# EAGLE design Seguidor (EAGLE 7.7.0)
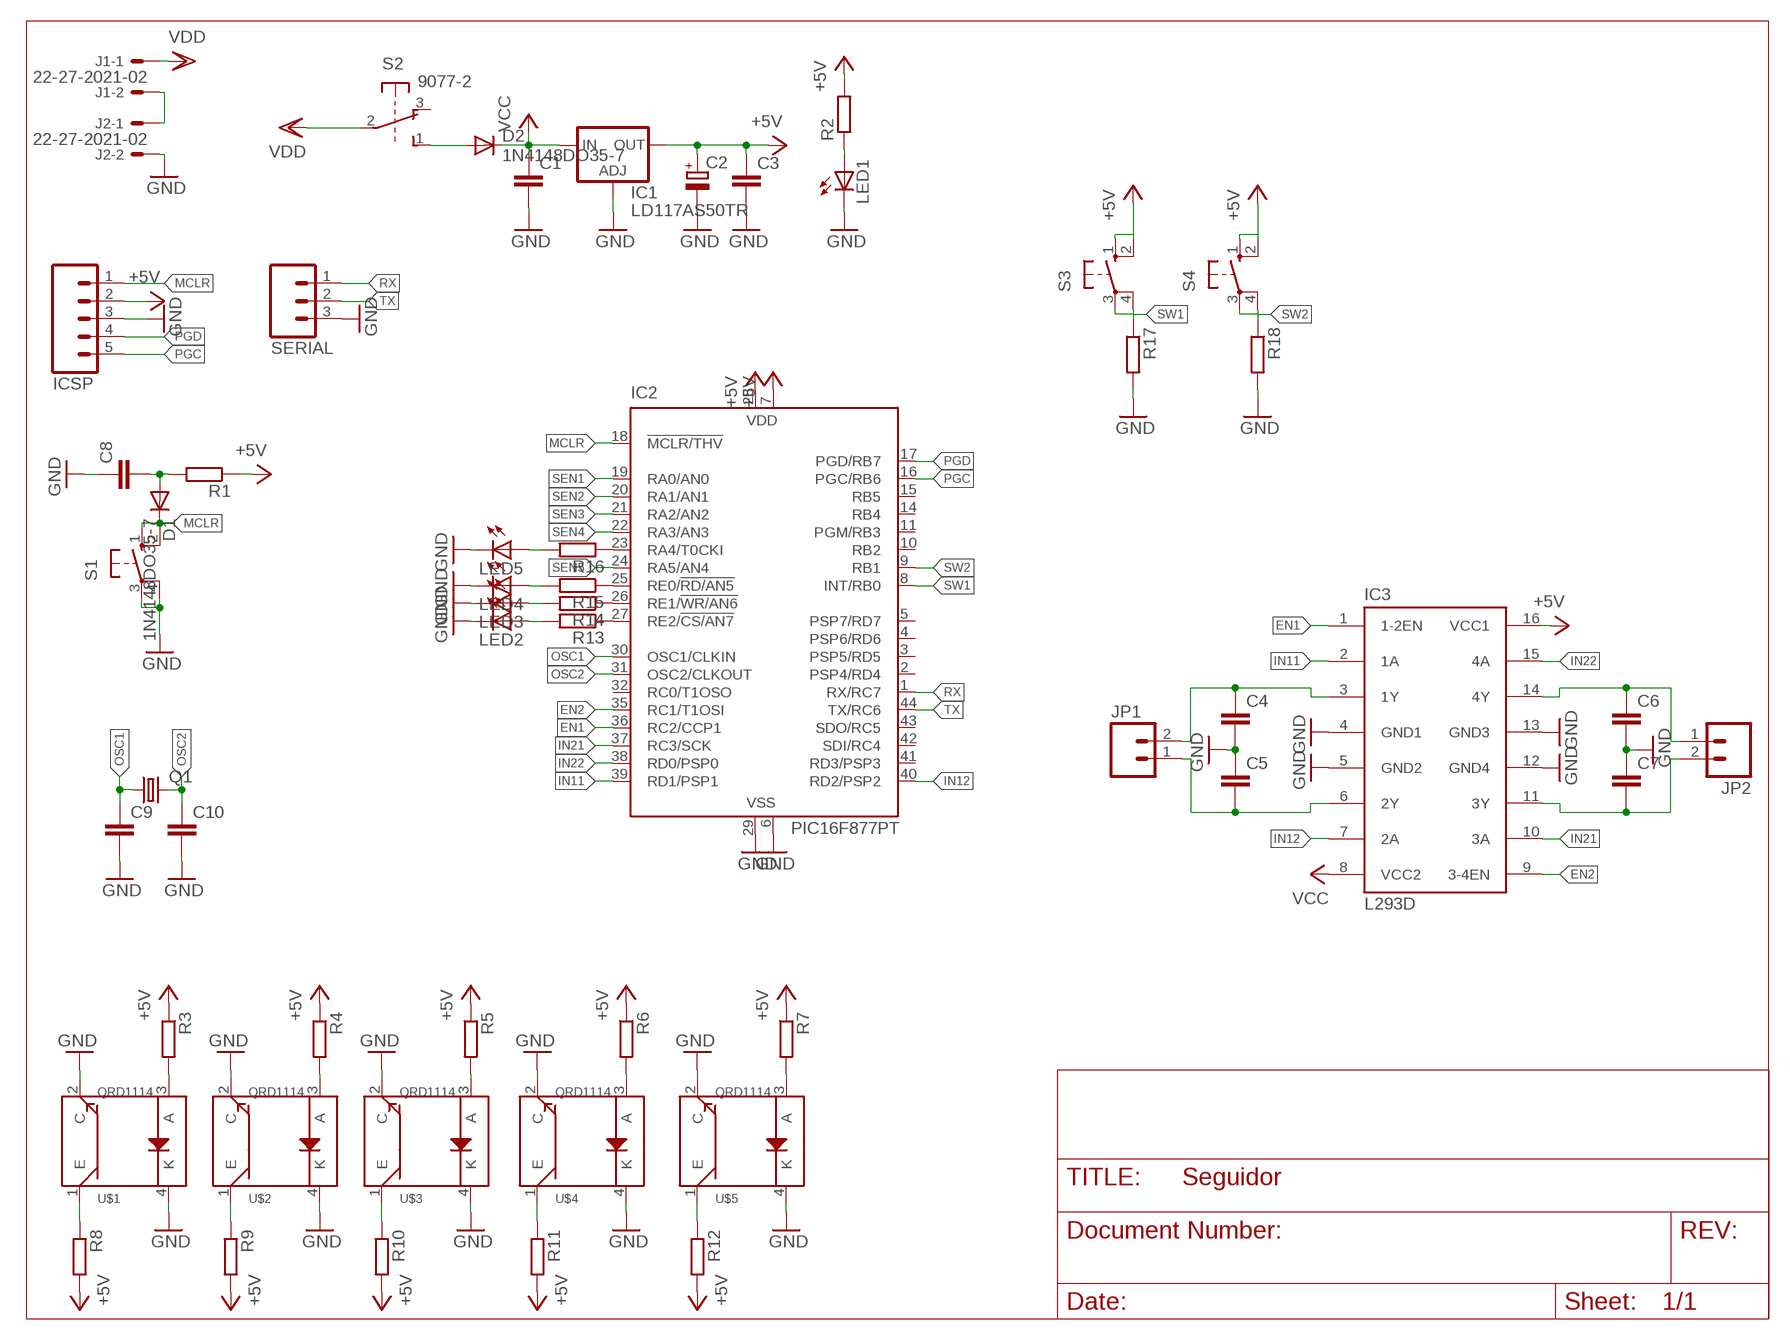
[diagram p0: schematic, sheet 1]

## Parts
C1  C-EU050-024X044  [C050-024X044]
C2  CPOL-EU153CLV-0405  [153CLV-0405]
C3  C-EU050-024X044  [C050-024X044]
C4  C-EU050-024X044  [C050-024X044]
C5  C-EU050-024X044  [C050-024X044]
C6  C-EU050-024X044  [C050-024X044]
C7  C-EU050-024X044  [C050-024X044]
C8  C-EU050-024X044  [C050-024X044]
C9  C-EU050-024X044  [C050-024X044]
C10  C-EU050-024X044  [C050-024X044]
D1  1N4148DO35-7  [DO35-7]
D2  1N4148DO35-7  [DO35-7]
IC1  LD117AS50TR  [SOT223]
IC2  PIC16F877PT  [TQFP44]
IC3  L293D  [DIL16]
ICSP  M05PTH_LONGPADS  [1X05_LONGPADS]
J1  22-27-2021-02  [6410-02]
J2  22-27-2021-02  [6410-02]
JP1  M02  [1X02_LONGPADS]
JP2  M02  [1X02_LONGPADS]
LED1  LED3MM  [LED3MM]
LED2  LED3MM  [LED3MM]
LED3  LED3MM  [LED3MM]
LED4  LED3MM  [LED3MM]
LED5  LED3MM  [LED3MM]
Q1  CRYSTALHC49UP  [HC49UP]
R1  R-EU_0207/7  [0207/7]
R2  R-EU_0207/7  [0207/7]
R3  R-EU_0207/7  [0207/7]
R4  R-EU_0207/7  [0207/7]
R5  R-EU_0207/7  [0207/7]
R6  R-EU_0207/7  [0207/7]
R7  R-EU_0207/7  [0207/7]
R8  R-EU_0207/7  [0207/7]
R9  R-EU_0207/7  [0207/7]
R10  R-EU_0207/7  [0207/7]
R11  R-EU_0207/7  [0207/7]
R12  R-EU_0207/7  [0207/7]
R13  R-EU_0207/7  [0207/7]
R14  R-EU_0207/7  [0207/7]
R15  R-EU_0207/7  [0207/7]
R16  R-EU_0207/7  [0207/7]
R17  R-EU_0207/7  [0207/7]
R18  R-EU_0207/7  [0207/7]
S1  10-XX  [B3F-10XX]
S2  9077-2  [9077-2]
S3  10-XX  [B3F-10XX]
S4  10-XX  [B3F-10XX]
SERIAL  M03LOCK_LONGPADS  [1X03_LOCK_LONGPADS]
U$1  QRD1114  [QRD1114]
U$2  QRD1114  [QRD1114]
U$3  QRD1114  [QRD1114]
U$4  QRD1114  [QRD1114]
U$5  QRD1114  [QRD1114]

## Nets
+5V: C2.+ C3.1 IC1.4(OUT) IC2.7(VDD) IC2.28(VDD) IC3.16(VCC1) ICSP.2 R1.1 R2.2 R3.1 R4.1 R5.1 R6.1 R7.1 R8.2 R9.2 R10.2 R11.2 R12.2 S3.1(S) S3.2(S1) S4.1(S) S4.2(S1)
EN1: IC2.36(RC2/CCP1) IC3.1(1-2EN)
EN2: IC2.35(RC1/T1OSI) IC3.9(3-4EN)
GND: C1.2 C2.- C3.2 C4.2 C5.1 C6.2 C7.1 C8.1 C9.2 C10.2 IC1.1(ADJ) IC2.6(VSS) IC2.29(VSS) IC3.4(GND1) IC3.5(GND2) IC3.12(GND4) IC3.13(GND3) ICSP.3 J2.2 LED1.K(C) LED2.K(C) LED3.K(C) LED4.K(C) LED5.K(C) R17.2 R18.2 S1.3(P) S1.4(P1) SERIAL.3 U$1.2(C) U$1.4(K) U$2.2(C) U$2.4(K) U$3.2(C) U$3.4(K) U$4.2(C) U$4.4(K) U$5.2(C) U$5.4(K)
IN11: IC2.39(RD1/PSP1) IC3.2(1A)
IN12: IC2.40(RD2/PSP2) IC3.7(2A)
IN21: IC2.37(RC3/SCK) IC3.10(3A)
IN22: IC2.38(RD0/PSP0) IC3.15(4A)
MCLR: D1.C IC2.18(!MCLR/THV) ICSP.1 S1.1(S) S1.2(S1)
N$1: J1.2 J2.1
N$2: LED1.A R2.1
N$3: C6.1 IC3.14(4Y) JP2.1
N$4: C4.1 IC3.3(1Y) JP1.2
N$5: C5.2 IC3.6(2Y) JP1.1
N$6: C7.2 IC3.11(3Y) JP2.2
N$7: D2.A S2.1(1:S)
N$9: C8.2 D1.A R1.2
N$10: R3.2 U$1.3(A)
N$11: R4.2 U$2.3(A)
N$12: R5.2 U$3.3(A)
N$13: R6.2 U$4.3(A)
N$14: R7.2 U$5.3(A)
N$15: IC2.27(RE2/!CS/AN7) R13.1
N$16: IC2.26(RE1/!WR/AN6) R14.1
N$17: IC2.25(RE0/!RD/AN5) R15.1
N$18: IC2.23(RA4/T0CKI) R16.1
N$19: LED3.A R14.2
N$20: LED2.A R13.2
N$21: LED4.A R15.2
N$22: LED5.A R16.2
OSC1: C9.1 IC2.30(OSC1/CLKIN) Q1.1
OSC2: C10.1 IC2.31(OSC2/CLKOUT) Q1.2
PGC: IC2.16(PGC/RB6) ICSP.5
PGD: IC2.17(PGD/RB7) ICSP.4
RX: IC2.1(RX/RC7) SERIAL.1
SEN1: IC2.19(RA0/AN0) R8.1 U$1.1(E)
SEN2: IC2.20(RA1/AN1) R9.1 U$2.1(E)
SEN3: IC2.21(RA2/AN2) R10.1 U$3.1(E)
SEN4: IC2.22(RA3/AN3) R11.1 U$4.1(E)
SEN5: IC2.24(RA5/AN4) R12.1 U$5.1(E)
SW1: IC2.8(INT/RB0) R17.1 S3.3(P) S3.4(P1)
SW2: IC2.9(RB1) R18.1 S4.3(P) S4.4(P1)
TX: IC2.44(TX/RC6) SERIAL.2
VCC: C1.1 D2.C IC1.3(IN) IC3.8(VCC2)
VDD: J1.1 S2.2(1:P)
Unconnected: IC2.2(PSP4/RD4) IC2.3(PSP5/RD5) IC2.4(PSP6/RD6) IC2.5(PSP7/RD7) IC2.10(RB2) IC2.11(PGM/RB3) IC2.14(RB4) IC2.15(RB5) IC2.32(RC0/T1OSO) IC2.41(RD3/PSP3) IC2.42(SDI/RC4) IC2.43(SDO/RC5) S2.3(1:O) S2.4(2:S) S2.5(2:P) S2.6(2:O)

## Library data of the parts
C1 C3-C10 = rcl:C-EU: CAPACITOR, European symbol
C2 = rcl:CPOL-EU: POLARIZED CAPACITOR, European symbol
D1 D2 = diode:1N4148: DIODE high speed (Philips)
IC1 = v-reg:LD117A?*: Low drop fixed and adjustable positive voltage regulators 1 A Source: http://www.st.com/stonline/products/literature/ds/7194/ld1117axx.pdf
IC2 = microchip:PIC16F87*: MICROCONTROLLER; MF: MICROCHIP; MPN: PIC16F877-04/PQ; OC_FARNELL: 9761411; OC_NEWARK: 23C5094
IC3 = st-microelectronics:L293D: PUSH-PULL 4 CHANNEL DRIVER; MPN: L293D; OC_FARNELL: 9589619; OC_NEWARK: 56P8249
ICSP = SparkFun:M05: Header 5 Standard 5-pin 0.1" header. Use with straight break away headers (SKU : PRT-00116), right angle break away headers (PRT-00553), swiss pins (PRT-00743), machine pins (PRT-00117), and female headers (PRT-00115). Molex polarized connector foot print use with SKU : PRT-08230 with associated crimp pins and housings.
J1 J2 = con-molex:22-?-02: CONNECTOR wire to board 2.54 mm (.1 inch) pitch header; OC_FARNELL: unknown; OC_NEWARK: unknown
JP1 JP2 = SparkFun:M02: Header 2 Standard 2-pin 0.1" header. Use with straight break away headers (SKU : PRT-00116), right angle break away headers (PRT-00553), swiss pins (PRT-00743), machine pins (PRT-00117), and female headers (PRT-00115). Molex polarized connector foot print use with SKU : PRT-08233 with associated crimp pins and housings.
LED1-LED5 = led:LED: LED OSRAM: - CHIPLED LG R971, LG N971, LY N971, LG Q971, LY Q971, LO R971, LY R971 LH N974, LH R974 LS Q976, LO Q976, LY Q976 LO Q996 - Hyper CHIPLED LW Q18S LB Q993, LB Q99A, LB R99A - SideLED LS A670, LO A670, LY A670, LG A670, LP A670 LB A673, LV A673, LT A673, LW A673 LH A674 LY A675 LS A676, LA A676, LO A676, LY A676, LW A676 LS A679, LY A679, LG A679 - Hyper Micro SIDELED® LS Y876, LA Y876, LO Y876, LY Y876 LT Y87S - SmartLED LW L88C, LW L88S LB L89C, LB L89S, LG L890 LS L89K, LO L89K, LY L89K LS L896, LA L896, LO L896, LY L896 - TOPLED LS T670, LO T670, LY T670, LG T670, LP T670 LSG T670, LSP T670, LSY T670, LOP T670, LYG T670 LG T671, LOG T671, LSG T671 LB T673, LV T673, LT T673, LW T673 LH T674 LS T676, LA T676, LO T676, LY T676, LB T676, LH T676, LSB T676, LW T676 LB T67C, LV T67C, LT T67C, LS T67K, LO T67K, LY T67K, LW E67C LS E67B, LA E67B, LO E67B, LY E67B, LB E67C, LV E67C, LT E67C LW T67C LS T679, LY T679, LG T679 LS T770, LO T770, LY T770, LG T770, LP T770 LB T773, LV T773, LT T773, LW T773 LH T774 LS E675, LA E675, LY E675, LS T675 LS T776, LA T776, LO T776, LY T776, LB T776 LHGB T686 LT T68C, LB T68C - Hyper Mini TOPLED® LB M676 - Mini TOPLED Santana® LG M470 LS M47K, LO M47K, LY M47K Source: http://www.osram.convergy.de LUXEON: - LUMILED® LXK2-PW12-R00, LXK2-PW12-S00, LXK2-PW14-U00, LXK2-PW14-V00 LXK2-PM12-R00, LXK2-PM12-S00, LXK2-PM14-U00 LXK2-PE12-Q00, LXK2-PE12-R00, LXK2-PE12-S00, LXK2-PE14-T00, LXK2-PE14-U00 LXK2-PB12-K00, LXK2-PB12-L00, LXK2-PB12-M00, LXK2-PB14-N00, LXK2-PB14-P00, LXK2-PB14-Q00 LXK2-PR12-L00, LXK2-PR12-M00, LXK2-PR14-Q00, LXK2-PR14-R00 LXK2-PD12-Q00, LXK2-PD12-R00, LXK2-PD12-S00 LXK2-PH12-R00, LXK2-PH12-S00 LXK2-PL12-P00, LXK2-PL12-Q00, LXK2-PL12-R00 Source: www.luxeon.com KINGBRIGHT: KA-3528ASYC Source: www.kingbright.com
Q1 = crystal:CRYSTAL: CRYSTAL; OC_FARNELL: unknown; OC_NEWARK: unknown
R1-R18 = rcl:R-EU_: RESISTOR, European symbol
S1 S3 S4 = switch-omron:10-XX: OMRON SWITCH; MPN: B3F-1000; OC_FARNELL: 176432; OC_NEWARK: 36M3542
S2 = switch-misc:9077-2: MARQUARDT SWITCH 9077.0200 Distributor: Buerklin <https://www.buerklin.com/default.asp?event=ShowArtikel%2812G2822%29&l=d&jump=ArtNr_12G2822>
SERIAL = SparkFun:M03: Header 3 Standard 3-pin 0.1" header. Use with straight break away headers (SKU : PRT-00116), right angle break away headers (PRT-00553), swiss pins (PRT-00743), machine pins (PRT-00117), and female headers (PRT-00115). Molex polarized connector foot print use with SKU : PRT-08232 with associated crimp pins and housings.
U$1-U$5 = SparkFun:QRD1114

## Board
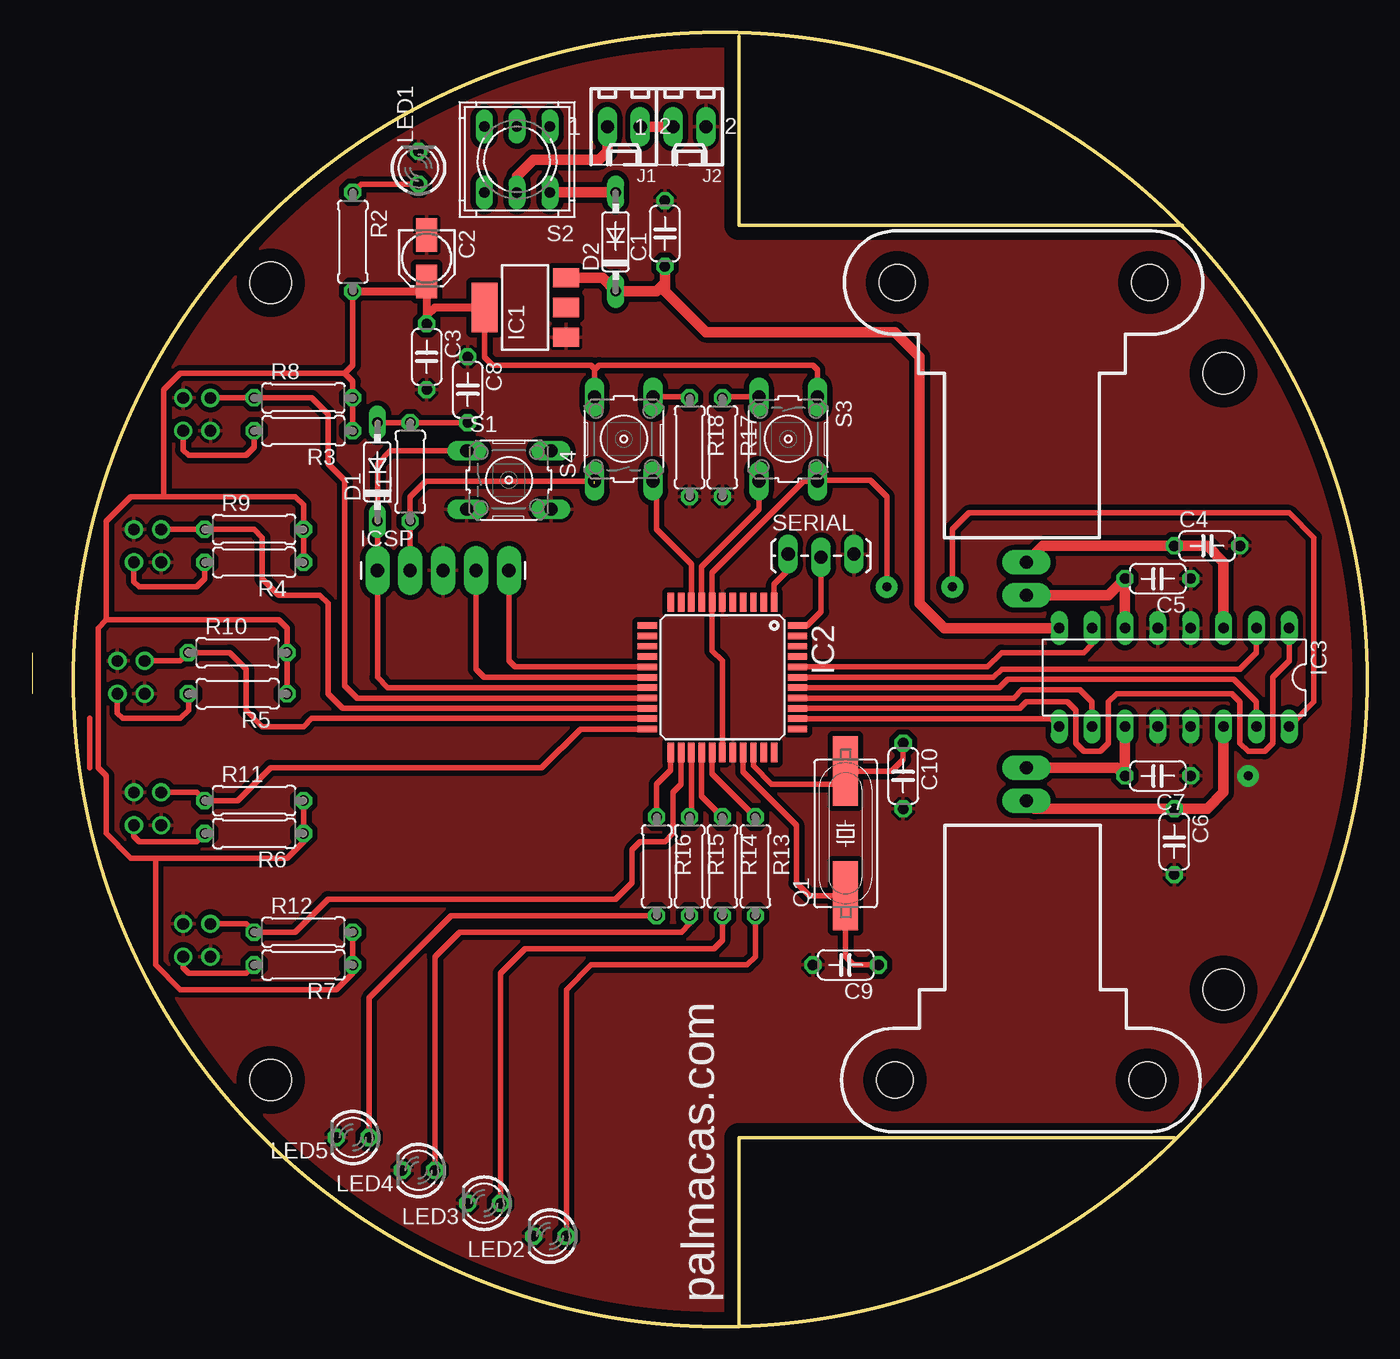
[diagram p1: board, top side]
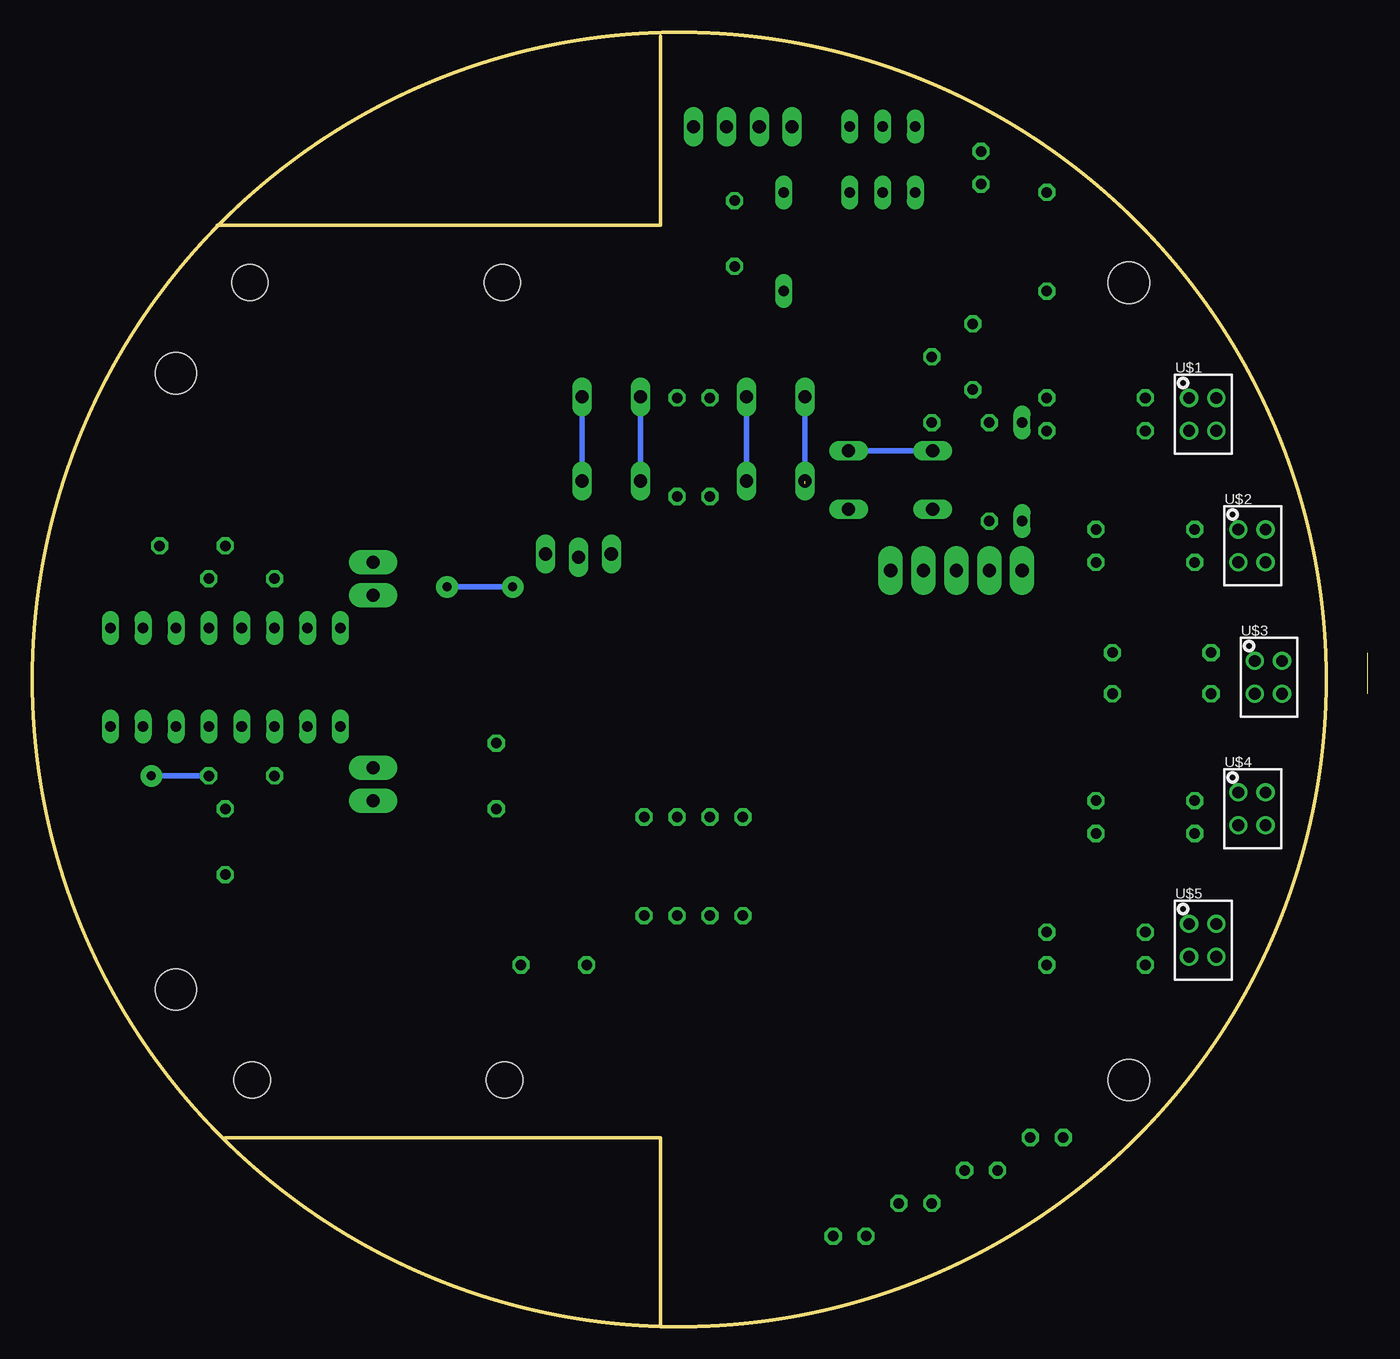
[diagram p2: board, bottom side, seen from below]

Size 103.17 x 100 mm. Coordinates in mm from the lower left corner, seen from the top.
Outline: 54.61,0 54.61,14.61 88.27,14.61
Outline: 54.61,99.69 54.61,85.09 88.9,85.09
Outline: 0,52.07 0,48.9
Outline: circle at 53.17,50 radius 50
Copper layers (1*16): Top 0.035mm / dielectric 1.5mm / Bottom 0.035mm
Design rules "default": minimum track width 10mil, minimum drill 24mil, track to track 8mil, track to pad 8mil, pad to pad 8mil, via to via 8mil, smd to smd 8mil, copper to edge 40mil, drill to drill 8mil, minimum pad ring 10mil, minimum via ring 8mil, stop-mask expansion 4mil, vias tented up to drill 0mil, thermal gap 10mil
Holes 3.2 mm at 92.08,73.66 92.08,26.04 18.41,80.64 18.41,19.05

### Footprints (pad centres in the part's own frame; a part is rotated, then mirrored left to right if it is on the bottom)
C050-024X044 = drill 0.813 octagon: 1 -2.54,0; 2 2.54,0
153CLV-0405 = smd 2.6 x 1.6: + 1.8,0; - -1.8,0
DO35-7 = drill 0.813 long: A 3.81,0; C -3.81,0
SOT223 = smd 1.5 x 2: 1 -2.3,-3.15; 2 0,-3.15; 3 2.3,-3.15 | smd 3.8 x 2: 4 0,3.15
TQFP44 = smd 1.5 x 0.5: 1 -5.8,4; 2 -5.8,3.2; 3 -5.8,2.4; 4 -5.8,1.6; 5 -5.8,0.8; 6 -5.8,0; 7 -5.8,-0.8; 8 -5.8,-1.6; 9 -5.8,-2.4; 10 -5.8,-3.2; 11 -5.8,-4; 23 5.8,-4; 24 5.8,-3.2; 25 5.8,-2.4; 26 5.8,-1.6; 27 5.8,-0.8; 28 5.8,0; 29 5.8,0.8; 30 5.8,1.6; 31 5.8,2.4; 32 5.8,3.2; 33 5.8,4 | smd 0.5 x 1.5: 12 -4,-5.8; 13 -3.2,-5.8; 14 -2.4,-5.8; 15 -1.6,-5.8; 16 -0.8,-5.8; 17 0,-5.8; 18 0.8,-5.8; 19 1.6,-5.8; 20 2.4,-5.8; 21 3.2,-5.8; 22 4,-5.8; 34 4,5.8; 35 3.2,5.8; 36 2.4,5.8; 37 1.6,5.8; 38 0.8,5.8; 39 0,5.8; 40 -0.8,5.8; 41 -1.6,5.8; 42 -2.4,5.8; 43 -3.2,5.8; 44 -4,5.8
DIL16 = drill 0.813 long: 1 -8.89,-3.81; 2 -6.35,-3.81; 3 -3.81,-3.81; 4 -1.27,-3.81; 5 1.27,-3.81; 6 3.81,-3.81; 7 6.35,-3.81; 8 8.89,-3.81; 9 8.89,3.81; 10 6.35,3.81; 11 3.81,3.81; 12 1.27,3.81; 13 -1.27,3.81; 14 -3.81,3.81; 15 -6.35,3.81; 16 -8.89,3.81
1X05_LONGPADS = drill 1.016 pad 1.88 long: 1 0,0; 2 2.54,0; 3 5.08,0; 4 7.62,0; 5 10.16,0
6410-02 = drill 1.016 long: 1 1.27,0; 2 -1.27,0
1X02_LONGPADS = drill 1.016 pad 1.88 long: 1 0,0; 2 2.54,0
LED3MM = drill 0.813 octagon: A -1.27,0; K 1.27,0
HC49UP = smd 5.334 x 1.93: 1 -4.826,0; 2 4.826,0
0207/7 = drill 0.813 octagon: 1 -3.81,0; 2 3.81,0
B3F-10XX = drill 1.016 long: 1 -3.251,2.261; 2 3.251,2.261; 3 -3.251,-2.261; 4 3.251,-2.261
9077-2 = drill 0.813 long: 1 -2.54,2.54; 2 0,2.54; 3 2.54,2.54; 4 -2.54,-2.54; 5 0,-2.54; 6 2.54,-2.54
1X03_LOCK_LONGPADS = drill 1.016 long: 1 0,0; 2 2.54,-0.254; 3 5.08,0
QRD1114 = drill 0.9: 1 -1.067,1.27; 2 -1.067,-1.27; 3 1.041,-1.27; 4 1.041,1.27
MINI_MOTOR = hole 2.8: -9.35,7; 10.16,7

### Placement (x,y rotation side)
C1  48.89,84.45 90 top
C2  30.48,82.55 270 top
C3  30.48,74.93 270 top
C4  90.8,60.33 0 top
C5  86.99,57.78 180 top
C6  88.27,37.47 270 top
C7  86.99,42.55 180 top
C8  33.66,72.39 270 top
C9  62.86,27.94 180 top
C10  67.31,42.55 270 top
D1  26.67,66.04 90 top
D2  45.08,83.82 90 top
IC1  38.1,78.74 90 top
IC2  53.34,50.16 270 top
IC3  88.27,50.16 180 top
ICSP  26.67,58.42 0 top
J1  45.72,92.71 180 top
J2  50.8,92.71 180 top
JP1  76.83,56.52 90 top
JP2  76.83,40.64 90 top
LED1  29.85,89.53 90 top
LED2  40,6.99 180 top
LED3  34.92,9.53 180 top
LED4  29.85,12.06 180 top
LED5  24.77,14.61 180 top
Q1  62.86,38.1 90 top
R1  29.21,66.04 90 top
R2  24.77,83.82 270 top
R3  20.96,69.22 180 top
R4  17.14,59.05 180 top
R5  15.88,48.9 180 top
R6  17.14,38.1 180 top
R7  20.96,27.94 180 top
R8  20.96,71.75 0 top
R9  17.14,61.59 0 top
R10  15.88,52.07 0 top
R11  17.14,40.64 0 top
R12  20.96,30.48 0 top
R13  55.88,35.56 270 top
R14  53.34,35.56 270 top
R15  50.8,35.56 270 top
R16  48.26,35.56 270 top
R17  53.34,67.94 270 top
R18  50.8,67.94 270 top
S1  36.83,65.41 0 top
S2  37.46,90.17 180 top
S3  58.42,68.58 270 top
S4  45.72,68.58 90 top
SERIAL  58.42,59.69 0 top
U$1  12.7,70.48 0 bottom
U$2  8.89,60.33 0 bottom
U$3  7.62,50.16 0 bottom
U$4  8.89,40.01 0 bottom
U$5  12.7,29.84 0 bottom
U$6  [MINI_MOTOR]  76.2,73.66 0 top
U$7  [MINI_MOTOR]  76.83,26.04 180 top

### Tracks (layer width: path | path; a pad name or v marks a point on that pad's centre or on a via)
+5V  (via drill 0.7 pad 1.68)  (1 unrouted)
  Top 0.406: R12.2 R7.1 24.77,27.3 23.5,26.04 11.43,26.04 9.52,27.94 9.52,36.2 | R11.2 R6.1 20.96,37.47 19.69,36.2 9.52,36.2 | R5.1 R10.2 19.69,53.98 19.05,54.61 5.71,54.61 | R4.1 R9.2 20.96,63.5 20.32,64.14 10.16,64.14 | R3.1 R8.2 24.77,73.03 24.13,73.66 | 5.71,54.61 5.08,53.98 5.08,43.18 5.71,42.55 5.71,38.1 7.62,36.2 9.52,36.2 | 10.16,64.14 7.62,64.14 5.71,62.23 5.71,54.61 | 24.13,73.66 11.43,73.66 10.16,72.39 10.16,64.14 | R2.2 24.77,74.3 24.13,73.66 | ICSP.2 R1.1 29.21,64.14 30.4,65.33 S4.1 | IC2.28 53.34,51.44 52.54,52.23 IC2.7 52.54,58.26 59.61,65.33 S3.2 60.88,65.33 60.96,65.41 64.77,65.41 66.04,64.14 v66.04,57.15 | S3.1 60.68,73.94 60.32,74.3 43.81,74.3 43.46,73.94 | S4.2 43.46,73.94 | IC1.4 34.95,74.91 35.56,74.3 43.18,74.3 43.46,74.02 43.46,73.94 | IC3.16 99.06,48.26 99.06,60.96 97.16,62.87 72.39,62.87 71.12,61.59 v71.12,57.15
  Top 0.61: 30.48,78.11 C2.+ 29.74,80.01 R2.2 | 30.48,78.11 C3.1 | IC1.4 31.12,78.74 30.48,78.11
  Bottom 0.406: v66.04,57.15 v71.12,57.15 | S3.1 S3.2 | S4.2 43.46,65.13
EN1
  Top 0.406: IC3.1 97.16,51.44 95.88,50.16 95.88,45.09 95.25,44.45 93.98,44.45 93.34,45.09 93.34,48.26 92.71,48.9 83.82,48.9 83.19,48.26 83.19,45.09 82.55,44.45 81.28,44.45 80.64,45.09 80.64,47.62 80.01,48.26 76.83,48.26 76.34,47.77 IC2.36
EN2
  Top 0.406: IC2.35 78.77,46.97 IC3.9
GND  (via drill 0.7 pad 1.68)
  Bottom 0.406: v93.98,42.55 C7.1
  pour Top (isolate 0.406): 3.17,-0.64 109.22,-0.64 109.22,100.33 3.17,100.33
IN11
  Top 0.406: IC2.39 74.3,50.16 74.93,50.8 93.34,50.8 94.61,52.07 IC3.2
IN12
  Top 0.406: IC2.40 73.83,50.97 74.93,52.07 81.28,52.07 81.91,52.7 IC3.7
IN21
  Top 0.406: IC3.10 81.91,48.26 80.97,49.2 76.5,49.2 75.87,48.56 IC2.37
IN22
  Top 0.406: IC3.15 94.61,48.26 92.88,50 75.4,50 74.77,49.37 IC2.38
MCLR
  Top 0.406: IC2.18 27.47,49.37 26.67,50.16 ICSP.1 D1.C 26.67,66.67 27.66,67.67 S1.1
  Bottom 0.406: S1.1 S1.2
N$1
  Top 0.813: J1.2 J2.1
N$2
  Top 0.406: R2.1 25.4,88.27 LED1.A
N$3
  Top 0.813: IC3.14 92.08,41.27 90.8,40.01 C6.1 77.47,40.01 JP2.1
N$4
  Top 0.813: IC3.3 92.08,59.05 90.8,60.33 C4.1 78.11,60.33 JP1.2
N$5
  Top 0.813: IC3.6 C5.2 83.19,56.52 JP1.1
N$6
  Top 0.813: IC3.11 C7.2 83.82,43.18 JP2.2
N$7
  Top 0.813: S2.1 D2.A
N$9
  Top 0.406: D1.A R1.2 C8.2
N$10
  Top 0.406: U$1.3 11.66,67.72 12.07,67.31 16.51,67.31 17.14,67.94 R3.2
N$11
  Top 0.406: U$2.3 7.85,57.56 8.25,57.15 12.7,57.15 13.34,57.78 R4.2
N$12
  Top 0.406: U$3.3 6.58,47.4 6.98,46.99 11.43,46.99 12.07,47.62 R5.2
N$13
  Top 0.406: U$4.3 7.85,37.87 8.25,37.47 12.7,37.47 R6.2
N$14
  Top 0.406: U$5.3 11.66,27.71 12.07,27.3 16.51,27.3 R7.2
N$15
  Top 0.406: IC2.27 52.54,42.71 R13.1
N$16
  Top 0.406: IC2.26 51.74,40.97 R14.1
N$17
  Top 0.406: IC2.25 50.94,39.87 R15.1
N$18
  Top 0.406: IC2.23 49.34,42.99 48.26,41.91 R16.1
N$19
  Top 0.406: R14.2 53.34,29.84 52.7,29.21 38.1,29.21 36.2,27.3 LED3.A
N$20
  Top 0.406: LED2.A 41.27,26.04 43.18,27.94 55.24,27.94 55.88,28.57 R13.2
N$21
  Top 0.406: R15.2 50.8,31.11 50.16,30.48 33.02,30.48 31.12,28.57 LED4.A
N$22
  Top 0.406: LED5.A 26.04,25.4 32.38,31.75 R16.2
N$23
  Top 0.406: 4.45,46.99 4.45,43.18
OSC1
  Top 0.406: IC2.30 54.94,42.85 59.05,38.73 59.05,34.29 60.07,33.27 Q1.1 62.86,28.57 63.5,27.94 C9.1
OSC2
  Top 0.406: IC2.31 55.74,43.32 57.15,41.91 61.85,41.91 Q1.2 66.42,42.93 67.31,43.81 C10.1
PGC
  Top 0.406: IC2.16 37.3,50.97 36.83,51.44 ICSP.5
PGD
  Top 0.406: IC2.17 34.92,50.16 34.29,50.8 ICSP.4
RX
  Top 0.406: SERIAL.1 58.42,58.42 57.34,57.34 IC2.1
SEN1
  Top 0.406: IC2.19 25.1,48.56 24.13,49.53 24.13,65.41 22.86,66.67 22.86,70.48 21.59,71.75 R8.1 U$1.1
SEN2
  Top 0.406: IC2.20 23.99,47.77 22.86,48.9 22.86,55.88 22.23,56.52 19.05,56.52 17.78,57.78 17.78,60.96 17.14,61.59 R9.1 U$2.1
SEN3
  Top 0.406: IC2.21 47.52,46.99 21.59,46.99 20.96,46.35 17.78,46.35 16.51,47.62 16.51,50.8 15.24,52.07 R10.1 11.43,51.44 U$3.1
SEN4
  Top 0.406: IC2.22 42.35,46.16 39.37,43.18 18.41,43.18 15.88,40.64 R11.1 12.7,41.27 U$4.1
SEN5
  Top 0.406: U$5.1 16.51,31.11 R12.1 20.32,30.48 22.86,33.02 45.08,33.02 46.35,34.29 46.35,36.83 46.99,37.47 48.89,37.47 49.53,38.1 49.53,41.27 50.14,41.88 IC2.24
SW1
  Top 0.406: IC2.8 51.74,58.73 56.16,63.14 S3.4 | S3.3 53.42,71.83 R17.1
  Bottom 0.406: S3.4 S3.3
SW2
  Top 0.406: IC2.9 50.94,58.91 48.26,61.59 48.26,65.05 S4.3 | S4.4 50.72,71.83 R18.1
  Bottom 0.406: S4.3 S4.4
TX
  Top 0.406: IC2.44 59.88,54.16 60.96,55.24 SERIAL.2
VCC
  Top 0.813: IC1.3 44.05,81.04 D2.C 48.26,80.01 48.89,80.64 | 48.89,80.64 C1.1 | 48.89,80.64 48.89,80.01 52.07,76.83 66.67,76.83 68.58,74.93 68.58,55.88 70.48,53.98 IC3.8
VDD
  Top 0.813: S2.2 37.46,88.9 38.73,90.17 43.81,90.17 44.45,90.81 J1.1

### Text on the board
tPlace: palmacas.com